# EAGLE board misko_1_board (EAGLE 9.6.2)
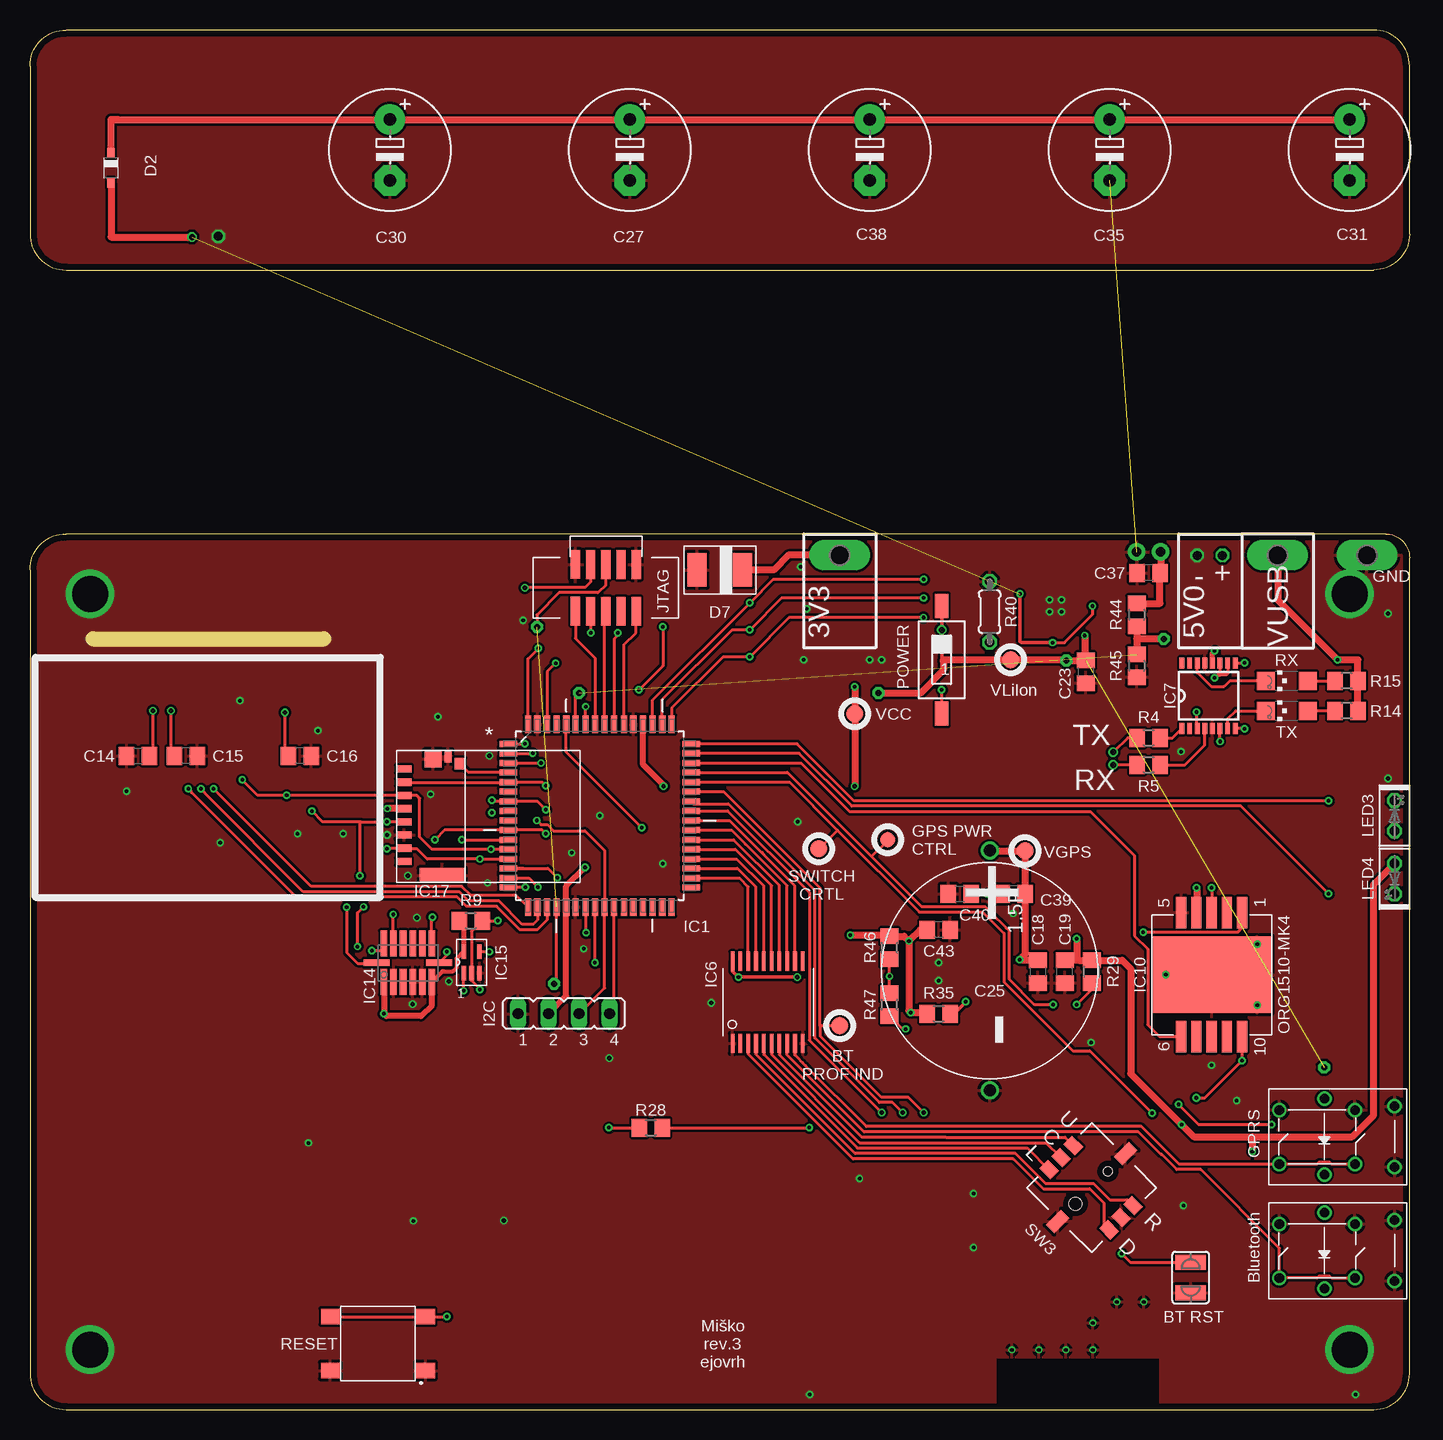
[diagram p6: board, top side]
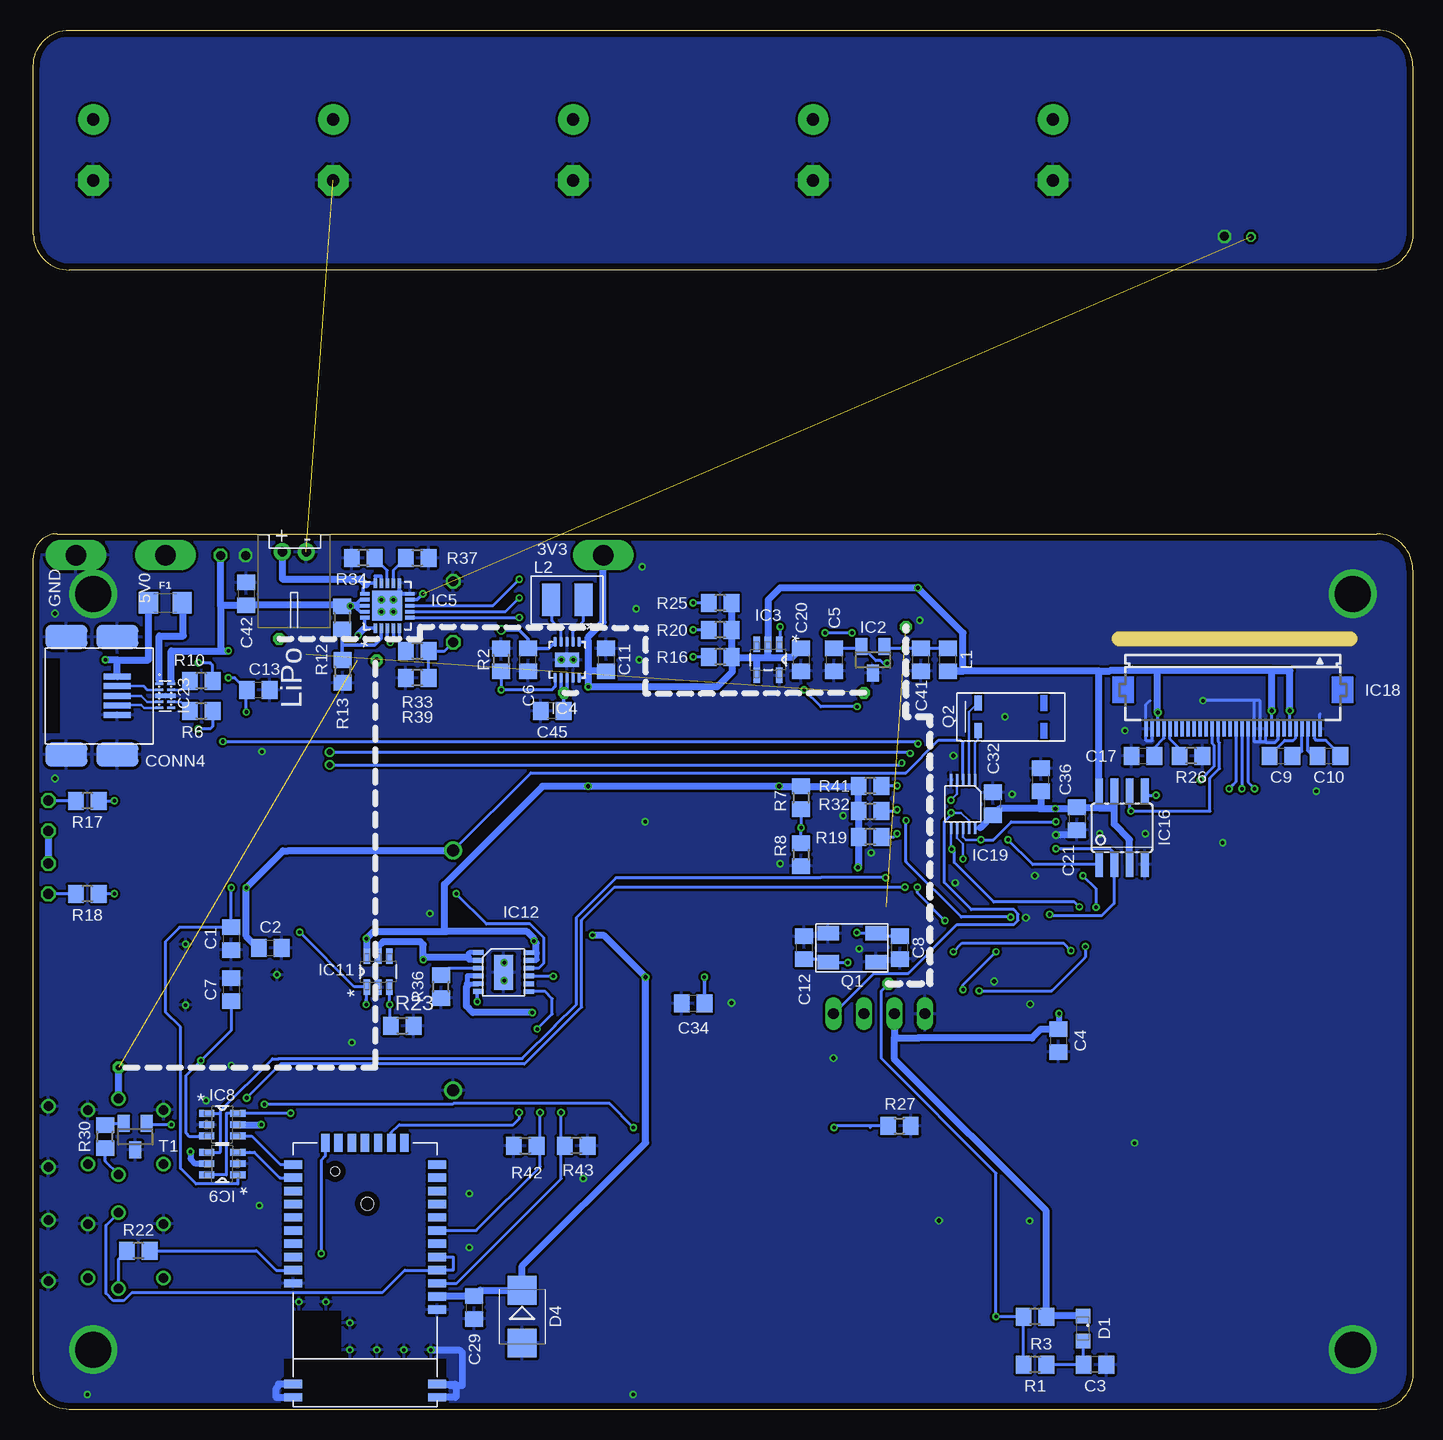
[diagram p7: board, bottom side, seen from below]

Size 115 x 115 mm. Coordinates in mm from the lower left corner, seen from the top.
Outline: 3,0 112,0 arc90 115,3 115,71 arc90 113,73 3,73 arc90 0,70 0,3 arc90 3,0
Outline: 3,95 112,95 arc90 115,98 115,112 arc90 112,115 3,115 arc90 0,112 0,98 arc90 3,95
Copper layers (1*16): Top 0.035mm / dielectric 1.5mm / Bottom 0.035mm
Design rules "markovac_2layer *": minimum track width 0.2mm, minimum drill 0.3mm, track to track 0.2mm, track to pad 0.2mm, pad to pad 0.2mm, via to via 0.2mm, smd to smd 0.2mm, copper to edge 0.5mm, drill to drill 8mil, minimum pad ring 0.15mm, minimum via ring 0.15mm, stop-mask expansion 4mil, vias tented up to drill 25mil, thermal gap 10mil
Net classes: 0 GND: width 0.4 mm, drill 0.25 mm, clearance 0.1 mm; 1 VCC: width 0.6 mm, drill 0.25 mm, clearance 0.1 mm to class 0, clearance 0.1 mm; 2 signal: width 0.25 mm, drill 0.25 mm, clearance 0.1 mm to class 0, clearance 0.1 mm to class 1, clearance 0.1 mm; 3 signal cross-board: width 0.25 mm, drill 0.25 mm, clearance 0.1 mm to class 0, clearance 0.1 mm to class 1, clearance 0.1 mm to class 2, clearance 0.1 mm
Milling: 1 lines

## Footprints (pad centres in the part's own frame; a part is rotated, then mirrored left to right if it is on the bottom)
C0805 = smd 1.3 x 1.5: 1 -0.95,0; 2 0.95,0
TH = drill 1: + 9.84,0; - -10.16,0
E5-10,5 = drill 1.016 pad 2.54: + -2.54,0 | drill 1.016 pad 2.54 octagon: - 2.54,0
TH-JTAG = smd 0.76 x 2.4: 1_JTAG_TCK -2.54,-1.94; 2_GND -2.54,1.955; 3_JTAG_TDO -1.27,-1.95; 4_VCC -1.27,1.95; 5_JTAG_TMS 0,-1.95; 6_JTAG_RST 0,1.95; 7_NC 1.27,-1.95; 8_NC 1.27,1.95; 9_JTAG_TDI 2.54,-1.95; 10_GND 2.54,1.95
JP4 = drill 0.914 long: 1 -3.81,0; 2 -1.27,0; 3 1.27,0; 4 3.81,0
JST-PH-2-THM-RA = drill 0.8 pad 1.422: 1 1,0; 2 -1,0
SMT = smd 2.25 x 0.5: D+ 0,0; D- 0,0.8; GND1 0,-1.6; ID 0,-0.8; VBUS 0,1.6 | smd 3.5 x 2: GND2 -4.25,-4.9; GND3 0,-4.9; GND4 0,4.9; GND5 -4.25,4.9
D0805 = smd 1.2 x 1.2: A 1.05,0; C -1.05,0
SOD323_ST = smd 0.8 x 0.6: A 1.25,0; C -1.25,0
SMB = smd 2.4 x 2.4: A 2.2,0; C -2.2,0
DO-214 = smd 1.6 x 2.8: AN 1.9,0; CAT -1.9,0
1206 = smd 1.6 x 1.8: 1 -1.4,0; 2 1.4,0
QFP80P1600X1600X120-64N = smd 1.473 x 0.508: 1 -7.62,5.994; 2 -7.62,5.207; 3 -7.62,4.394; 4 -7.62,3.607; 5 -7.62,2.794; 6 -7.62,2.007; 7 -7.62,1.194; 8 -7.62,0.406; 9 -7.62,-0.406; 10 -7.62,-1.194; 11 -7.62,-2.007; 12 -7.62,-2.794; 13 -7.62,-3.607; 14 -7.62,-4.394; 15 -7.62,-5.207; 16 -7.62,-5.994; 33 7.62,-5.994; 34 7.62,-5.207; 35 7.62,-4.394; 36 7.62,-3.607; 37 7.62,-2.794; 38 7.62,-2.007; 39 7.62,-1.194; 40 7.62,-0.406; 41 7.62,0.406; 42 7.62,1.194; 43 7.62,2.007; 44 7.62,2.794; 45 7.62,3.607; 46 7.62,4.394; 47 7.62,5.207; 48 7.62,5.994 | smd 0.508 x 1.473: 17 -5.994,-7.62; 18 -5.207,-7.62; 19 -4.394,-7.62; 20 -3.607,-7.62; 21 -2.794,-7.62; 22 -2.007,-7.62; 23 -1.194,-7.62; 24 -0.406,-7.62; 25 0.406,-7.62; 26 1.194,-7.62; 27 2.007,-7.62; 28 2.794,-7.62; 29 3.607,-7.62; 30 4.394,-7.62; 31 5.207,-7.62; 32 5.994,-7.62; 49 5.994,7.62; 50 5.207,7.62; 51 4.394,7.62; 52 3.607,7.62; 53 2.794,7.62; 54 2.007,7.62; 55 1.194,7.62; 56 0.406,7.62; 57 -0.406,7.62; 58 -1.194,7.62; 59 -2.007,7.62; 60 -2.794,7.62; 61 -3.607,7.62; 62 -4.394,7.62; 63 -5.207,7.62; 64 -5.994,7.62
SOT23 = smd 1 x 1.4: 1 -0.95,-1.1; 2 0.95,-1.1; 3 0,1.1
SOT95P280X145-5N = smd 1.27 x 0.559: 1 -1.295,0.94; 2 -1.295,0; 3 -1.295,-0.94; 4 1.295,-0.94; 5 1.295,0.94
SMT' = smd 0.8 x 0.28: 1_VOUT -1.5,1; 2_L2 -1.5,0.5; 3_PGND -1.5,0; 4_L1 -1.5,-0.5; 5_VIN -1.5,-1; 6_EN 1.5,-1; 7_PS/SYNC 1.5,-0.5; 8_VINA 1.5,0; 9_GND1 1.5,0.5; 10_FB 1.5,1 | smd 1.2 x 2: GND2 0,0 | drill 0.3 pad 0.61: GND3 0,0.5; GND4 0,-0.5
QFN50P400X400X100-21N = smd 0.8 x 0.3: 1_OUT1 -1.88,0.991; 2_VPCC -1.88,0.508; 3_SEL -1.88,0; 4_PROG2 -1.88,-0.508; 5_THERM -1.88,-0.991; 11_GND2 1.88,-0.991; 12_PROG3 1.88,-0.508; 13_PROG1 1.88,0; 14_VBAT1 1.88,0.508; 15_VBAT2 1.88,0.991 | smd 0.3 x 0.8: 7_STAT2 -0.508,-1.88; 8_STAT1 0,-1.88; 9_!TE! 0.508,-1.88; 10_GND1 0.991,-1.88; 16_BAT_SENSE 0.991,1.88; 17_CE 0.508,1.88; 18_IN1 0,1.88; 19_IN2 -0.508,1.88; 20_OUT2 -0.991,1.88; !6_PG! -0.991,-1.88 | smd 2.5 x 2.5: GND2 0,0 | drill 0.3 pad 0.61: GND3 -0.5,-0.5; GND4 0.5,-0.5; GND5 0.5,0.5; GND6 -0.5,0.5
TSSOP20 = smd 0.3 x 1.6: !CH! 2.92,3.525; !EN! -2.93,-3.325; GND 2.92,-3.325; IN1 -2.28,-3.325; IN2 -1.63,-3.325; IN3 -0.98,-3.325; IN4 -0.33,-3.325; IN5 0.32,-3.325; IN6 0.97,-3.325; IN7 1.62,-3.325; IN8 2.27,-3.325; OUT1 -2.28,3.525; OUT2 -1.63,3.525; OUT3 -0.98,3.525; OUT4 -0.33,3.525; OUT5 0.32,3.525; OUT6 0.97,3.525; OUT7 1.62,3.525; OUT8 2.27,3.525; VCC -2.93,3.525
SSOP16 = smd 0.914 x 0.406: 1 -2.718,2.223; 2 -2.718,1.587; 3 -2.718,0.953; 4 -2.718,0.318; 5 -2.718,-0.318; 6 -2.718,-0.953; 7 -2.718,-1.587; 8 -2.718,-2.223; 9 2.718,-2.223; 10 2.718,-1.587; 11 2.718,-0.953; 12 2.718,-0.318; 13 2.718,0.318; 14 2.718,0.953; 15 2.718,1.587; 16 2.718,2.223
SOT95P280X145-6N = smd 1.27 x 0.559: 1 -1.295,0.94; 2 -1.295,0; 3 -1.295,-0.94; 4 1.295,-0.94; 5 1.295,0; 6 1.295,0.94
PACKAGE = smd 2.591 x 0.864: 1PPS 5.168,-1.27; CTS -5.168,1.27; GND3 5.168,2.54; ON_OFF 5.168,-2.54; RESET -5.168,0; RTS -5.168,-1.27; RX -5.168,-2.54; TX 5.168,0; VCC 5.168,1.27; WAKEUP -5.168,2.54 | drill 0.3: GND1 -2.54,-3.81; GND4 0,3.81; GND5 2.54,-3.81 | smd 6.4 x 10: GND2 0,0
MSOP = smd 0.4 x 0.9: !PFO! 1.01,2.05; EN 1.65,-2.15; FB 1,-2.15; PFI 0.36,2.05; PFI_RET 1.66,2.05; PROG -0.3,-2.15; SEL 0.35,-2.15; VIN1 -0.94,2.05; VIN2 -1.59,2.05; VMID -0.29,2.05; VOUT1 -1.6,-2.15; VOUT2 -0.95,-2.15 | smd 2.9 x 1.6: GND1 0.05,-0.05 | drill 0.3: GND2 -0.75,0; GND3 0.75,0
SMT'' = smd 0.7 x 1.5: !RST_N! 9.3,0; EAN 8.2,0; P0_0/RTS 4.9,0; P0_5 3.8,0; P1_7/CTS 2.7,0; P2_0 6,0; P2_4 7.1,0 | smd 1.5 x 0.7: BAT_IN 0,12.8; GND7 0,21.2; GND8 0,20.1; GND9 0,13.9; GND10 12,11.7; GND11 12,20.1; GND12 12,21.2; LDO18_O 0,8.4; LDO33_O 0,10.6; LED 12,10.6; P0_4 0,5.1; P1_2/SCL 0,2.9; P1_3/SDA 0,1.8; P1_5 0,4; P3_1 12,4; P3_2 12,5.1; P3_3 12,6.2; P3_4 12,7.3; P3_6 12,8.4; P3_7 12,9.5; PMULDO_O 0,6.2; RXD 12,1.8; SW_BTN 0,11.7; TXD 12,2.9; VDD_IO 0,9.5; WAKEUP 0,7.3 | drill 0.3: GND 0.5,17.25; GND1 2.75,17.25; GND2 5,17.25; GND3 7.25,17.25; GND4 7.25,15; GND5 9.25,13.25; GND6 11.5,13.25
LGA14 = smd 0.55 x 2.145: !CS! 0,-2.6; SCL 0,2.6 | smd 2.145 x 0.55: GND1 -1.6,-1.2; GND2 -1.6,-0.4; GND3 -1.6,1.2; INT1 1.6,-2; INT2 1.6,-1.2; NC 1.6,-0.4; RESERVED1 1.6,0.4; RESERVED2 -1.6,0.4; SDA 1.6,2; SDO 1.6,1.2; VCC -1.6,-2; VDD -1.6,2
SOT353/5 = smd 0.4 x 1.2: A 0,-0.9; B -0.65,-0.9; GND 0.65,-0.9; VCC -0.65,0.9; Y 0.65,0.9
SOIC08 = smd 0.66 x 2.032: !CS! -1.905,-3.073; !HOLD! -0.635,3.073; !WP! 0.635,-3.073; GND 1.905,-3.073; SCK 0.635,3.073; SI 1.905,3.073; SO -0.635,-3.073; VCC -1.905,3.073
MICRO_SD_CONNECTOR = smd 0.6 x 1.25: CD/DAT3 8.35,-0.63; CLK 5.05,-0.63; CMD 7.25,-0.63; DAT0 2.85,-0.63; DAT1 1.75,-0.63; DAT2 9.45,-0.63; VDD 6.15,-0.63; VSS 3.95,-0.63 | smd 0.95 x 0.85: DET 9.9,-5.27 | smd 1.45 x 1.4: GND2 10.3,-3.05 | smd 1.2 x 3.79: GND4 0.6,-3.81 | smd 1 x 0.6: POL 10.5,-4.3
FH12-30S-0.5SH = smd 0.3 x 1.3: 1 -7.25,3.25; 2 -6.75,3.25; 3 -6.25,3.25; 4 -5.75,3.25; 5 -5.25,3.25; 6 -4.75,3.25; 7 -4.25,3.25; 8 -3.75,3.25; 9 -3.25,3.25; 10 -2.75,3.25; 11 -2.25,3.25; 12 -1.75,3.25; 13 -1.25,3.25; 14 -0.75,3.25; 15 -0.25,3.25; 16 0.25,3.25; 17 0.75,3.25; 18 1.25,3.25; 19 1.75,3.25; 20 2.25,3.25; 21 2.75,3.25; 22 3.25,3.25; 23 3.75,3.25; 24 4.25,3.25; 25 4.75,3.25; 26 5.25,3.25; 27 5.75,3.25; 28 6.25,3.25; 29 6.75,3.25; 30 7.25,3.25
10UMAX = smd 1 x 0.2: !CS! -2,-0.5; !INT! 2,0.5; DIN 2,-1; DOUT 2,-0.5; GND -2,-1; SCLK 2,0; VBACK -2,0; VCC 2,1; X1 -2,1; X2 -2,0.5
μDFN-10 = smd 0.2 x 0.675: 1 -1,-0.5; 2 -0.5,-0.5; 4 0.5,-0.5; 5 1,-0.5; 6 1,0.5; 7 0.5,0.5; 9 -0.5,0.5; 10 -1,0.5 | smd 0.4 x 1.7: 3 0,0
L0805 = smd 1.3 x 1.5: 1 -0.95,0; 2 0.95,0
FFF = smd 1.5 x 2.7: P$1 1.35,-0.01; P$2 -1.35,0.01
CHIPLED_1206 = smd 1.5 x 1.5: A 0,-1.75; C 0,1.75
LED2X5 = drill 0.813 octagon: A -1.27,0; K 1.27,0
SMT''' = smd 1.8 x 1.2: GND1 -2,1.2; GND2 2,-1.2; Q1 -2,-1.2; Q2 2,1.2
SMD = smd 0.635 x 1.27: XTAL1 -2.75,-1.15; XTAL2 -2.75,1.15
R0805 = smd 1.3 x 1.5: 1 -0.95,0; 2 0.95,0
0204/5 = drill 0.813 octagon: 1 -2.54,0; 2 2.54,0
SJW = smd 1.27 x 2.54: 1 -1.27,0; 2 1.27,0
430152050836 = smd 1.55 x 1.3: 1 -3.975,2.25; 2 -3.975,-2.25; 3 3.975,2.25; 4 3.975,-2.25
SMS-001 = smd 1.092 x 2.007: 1 0,-4.496; 2 0,4.496
MICROJOYSTICK = smd 1.3 x 1: CENTER -3.575,-0.035; DOWN 3.52,-1.46; GND1 3.52,-0.035; LEFT -3.57,-1.46; RIGHT 3.52,1.39; UP -3.555,1.405 | smd 1 x 1.8: GND2 0,4; GND3 0,-4 | hole 0.75: 0,1.9 | hole 1.05: 0,-1.9
TH' = drill 0.8: 1 9.602,-2.214; 2 3.302,-2.214; 3 9.602,2.286; 4 3.302,2.286; GND1 0,-2.54; GND2 0,2.54; L1 5.85,-3.15; L2 5.85,3.15
P1-17Y = drill 1.702 pad 2.121 long: TP 0,0
TP14R = smd 1.4 x 1.4: TP 0,0
B1,27 = smd 1.27 x 1.27: TP 0,0

## Placement (x,y rotation side)
C1  18pF  [C0805]  98.5,39.25 270 bottom
C2  1µF  [C0805]  95.25,38.5 0 bottom
C3  0.1µF  [C0805]  26.5,3.75 180 bottom
C4  0.1µF  [C0805]  29.55,30.75 270 bottom
C5  10µF  [C0805]  48.25,62.5 270 bottom
C6  10µF  [C0805]  73.75,62.5 90 bottom
C7  18pF  [C0805]  98.5,35 270 bottom
C8  7pF  [C0805]  42.75,38.5 90 bottom
C9  1µF  [C0805]  11,54.5 0 bottom
C10  1µF  [C0805]  7,54.5 0 bottom
C11  22µF  [C0805]  67.25,62.5 270 bottom
C12  7pF  [C0805]  50.75,38.5 270 bottom
C13  0.1µF  [C0805]  96.25,60 0 bottom
C14  1µF  [C0805]  9,54.5 0 top
C15  1µF  [C0805]  13,54.5 180 top
C16  10µF  [C0805]  22.5,54.5 180 top
C17  2.2µF / 25V  [C0805]  22.5,54.5 0 bottom
C18  1nF  [C0805]  84,36.5 270 top
C19  0.1µF  [C0805]  86.25,36.5 90 top
C20  0.1µF  [C0805]  51,62.5 270 bottom
C21  0.1µF  [C0805]  28,49.25 270 bottom
C23  10µF  [C0805]  88,61.5 270 top
C25  1.5F  [TH]  80,36.75 90 top
C27  1000µF  [E5-10,5]  50,105 270 top
C29  10µF  [C0805]  78.25,8.5 270 bottom
C30  1000µF  [E5-10,5]  30,105 270 top
C31  1000µF  [E5-10,5]  110,105 270 top
C32  0.1µF  [C0805]  35,50.5 90 bottom
C34  10µF  [C0805]  60,33.85 180 bottom
C35  1000µF  [E5-10,5]  90,105 270 top
C36  0.1µF  [C0805]  31,52.5 90 bottom
C37  10µF  [C0805]  93.25,69.75 180 top
C38  1000µF  [E5-10,5]  70,105 270 top
C39  100µF  [C0805]  82,43 180 top
C40  100µF  [C0805]  77.5,43 0 top
C41  0.1µF  [C0805]  41,62.5 90 bottom
C42  0.1µF  [C0805]  97.25,68 270 bottom
C43  0.1µF  [C0805]  75.75,40 180 top
C45  0.1µF  [C0805]  71.75,58.25 180 bottom
CONN1  JTAG  [TH-JTAG]  48,68.5 0 top
CONN2  I2C  [JP4]  44.5,33 0 top
CONN3  LiPo Battery  [JST-PH-2-THM-RA]  93.25,71.5 180 bottom
CONN4  USB mini B  [SMT]  108,59.5 0 bottom
D1  1N4148  [D0805]  27.5,6.75 270 bottom
D2  BAT60AE6327  [SOD323_ST]  6.75,103.5 270 top
D4  SZ1SMB5916BT3G  [SMB]  74.25,7.75 270 bottom
D7  BZG05C3V6-E3-TR3  [DO-214]  57.5,70 180 top
F1  PTS120615V050  [1206]  104,67.25 0 bottom
IC1  ATMEGA1281-16AU  [QFP80P1600X1600X120-64N]  47.5,49.5 0 top
IC2  MC1525TT  [SOT23]  45,62.5 180 bottom
IC3  TMP36GRTZ  [SOT95P280X145-5N]  53.75,62.5 270 bottom
IC4  TPS63031  [SMT']  70.5,62.5 270 bottom
IC5  MCP73871-2AAI/ML  [QFN50P400X400X100-21N]  85.49,67.01 90 bottom
IC6  MAX6818  [TSSOP20]  61.5,33.85 0 top
IC7  FT230XS  [SSOP16]  98.25,59.5 90 top
IC8  SN74LVC1G3157DBVR - BT switch  [SOT95P280X145-6N]  99.25,23.75 0 bottom
IC9  SN74LVC1G3157DBVR - GPS switch  [SOT95P280X145-6N]  99.25,20.5 180 bottom
IC10  ORG1510-MK4  [PACKAGE]  98.5,36.25 90 top
IC11  TPS3808G33DBVT  [SOT95P280X145-6N]  86.25,36.5 90 bottom
IC12  LTC4425  [MSOP]  75.75,36.5 270 bottom
IC13  RN4678_BT_MODULE  [SMT'']  81.36,22.22 180 bottom
IC14  ADXL345  [LGA14]  31.5,37.25 90 top
IC15  74HCT1G32  [SOT353/5]  36.81,37.28 0 top
IC16  FM25W256-SOIC  [SOIC08]  24.25,48.5 0 bottom
IC17  MICROSD_SPI_MODE  [MICRO_SD_CONNECTOR]  30.55,43.94 90 top
IC18  FH12-30S-0.5SH  [FH12-30S-0.5SH]  15,60 180 bottom
IC19  DS1394U-33+  [10UMAX]  37.5,50.5 270 bottom
IC23  SP3012-04UTG  [μDFN-10]  104,59.5 270 bottom
L1  DL0805-33 33µH  [L0805]  38.75,62.5 90 bottom
L2  DJNR3015-1R5  [FFF]  70.5,67.5 180 bottom
LED1  TX  [CHIPLED_1206]  104.75,58.25 90 top
LED2  RX  [CHIPLED_1206]  104.75,60.75 90 top
LED3  green  [LED2X5]  113.75,49.5 90 top
LED4  red  [LED2X5]  113.75,44.25 270 top
Q1  ABM3B-8MHZ-10-1-U-T  [SMT''']  46.75,38.5 180 bottom
Q2  LFXTAL016178R  [SMD]  33.5,57.75 0 bottom
R1  47k  [R0805]  31.5,3.75 180 bottom
R2  10k  [R0805]  76,62.49 270 bottom
R3  4k7  [R0805]  31.5,7.75 180 bottom
R4  3k3  [R0805]  93.25,56 0 top
R5  3k3  [R0805]  93.25,53.75 0 top
R6  27  [R0805]  101,58.25 0 bottom
R7  150k  [R0805]  51,51 270 bottom
R8  150k  [R0805]  51,46.25 270 bottom
R9  10k  [R0805]  36.75,40.75 0 top
R10  27  [R0805]  101,60.75 180 bottom
R12  100k  [R0805]  89.25,66 270 bottom
R13  270k  [R0805]  89.21,61.53 270 bottom
R14  1k  [R0805]  109.75,58.25 180 top
R15  1k  [R0805]  109.75,60.75 180 top
R16  47k  [R0805]  57.75,62.75 180 bottom
R17  1k  [R0805]  110.5,50.75 180 bottom
R18  1k  [R0805]  110.5,43 180 bottom
R19  10k  [R0805]  45.25,47.75 180 bottom
R20  47k  [R0805]  57.75,65 180 bottom
R22  1k  [R0805]  106.25,13.25 180 bottom
R23  10k  [R0805]  84.25,32 0 bottom
R25  47k  [R0805]  57.75,67.25 180 bottom
R26  390k  [R0805]  18.5,54.5 180 bottom
R27  10k  [R0805]  42.8,23.65 0 bottom
R28  10k  [R0805]  51.75,23.5 0 top
R29  1M  [R0805]  88.5,36.5 90 top
R30  1k  [R0805]  109,22.75 90 bottom
R32  10k  [R0805]  45.25,49.88 0 bottom
R33  1k  [R0805]  83,63.25 0 bottom
R34  1k  [R0805]  87.5,71 180 bottom
R35  1k  [R0805]  75.75,33 0 top
R36  10k  [R0805]  81,35.25 90 bottom
R37  100k  [R0805]  83,71 0 bottom
R39  270k  [R0805]  83,61 180 bottom
R40  NTC 10k  [0204/5]  80,66.5 90 top
R41  10k  [R0805]  45.25,52 180 bottom
R42  10k  [R0805]  74,22 0 bottom
R43  10k  [R0805]  69.75,22 180 bottom
R44  150k  [R0805]  92.25,66.25 270 top
R45  150k  [R0805]  92.25,62 270 top
R46  470k  [R0805]  71.65,38.5 90 top
R47  470k  [R0805]  71.65,33.75 90 top
SJ3  RESET  [SJW]  96.75,11 270 top
SW1  RESET  [430152050836]  29,5.5 180 top
SW2  POWER SWITCH  [SMS-001]  76,62.5 0 top
SW3  MICROJOYSTICK  [MICROJOYSTICK]  88.5,18.5 315 top
SW4  PB6156RSL  [TH']  113.75,13.25 180 top
SW5  PB6156RSL  [TH']  113.75,22.75 180 top
T1  BSS84  [SOT23]  106.5,22.75 180 bottom
TP1  GND  [P1-17Y]  111.45,71.21 270 top
TP2  GND  [P1-17Y]  104,71.22 270 top
TP3  GND  [P1-17Y]  67.5,71.22 270 top
TP4  VCC  [TP14R]  68.75,58 180 top
TP5  VLiIon Regulated  [TP14R]  81.75,62.5 0 top
TP6  VGPS  [TP14R]  82.94,46.58 0 top
TP7  Analogue Switch CRTL Pin  [TP14R]  65.76,46.77 0 top
TP8  GPS Power CTRL Pin  [B1,27]  71.5,47.5 0 top
TP11  Bluetooth Wakeup Pin  [TP14R]  67.5,32 0 top

## Tracks (layer width: path | path; a pad name or v marks a point on that pad's centre or on a via)
5V0  (via drill 0.3, 0.5, 0.75)  (1 unrouted)
  Top 0.25: v85.25,63.93 86.23,63.93 88.6,66.3 88.6,66.95 v88.57,66.98
  Top 0.3: v85.25,63.93 82.63,63.93 82.53,64.03 v82.53,68
  Top 0.4: IC7.12 98.57,63.07 v98.75,63.25
  Top 0.6: D2.A 6.75,97.75 v13.5,97.75 | 99.42,71.19 v99.4,71.2
  Bottom 0.25: IC23.10 103.5,60.69
  Bottom 0.3: IC5.19_IN2 87.75,66.5 88,66.75 88,67.03 | IC5.17_CE 87.73,67.52 88,67.25 88,67.03 | IC5.18_IN1 87.98,67.01 88,67.03 | 88.54,67.01 v88.57,66.98 | IC5.4_PROG2 84.98,64.2 v85.25,63.93 85.49,64.17 IC5.3_SEL | IC5.9_!TE! 83.01,67.52 v82.53,68
  Bottom 0.6: 87.98,67.01 88.54,67.01 | v88.57,66.98 89.16,66.98 89.23,67.05 | 89.23,67.05 C42.2 99.35,67.05 99.4,67 | R12.1 89.25,67.03 89.23,67.05 | 99.4,67 v99.4,71.2 | 99.4,67 99.4,63.25 | 99.4,63.25 v98.75,63.25 | 103.5,60.69 103.5,63.25 99.4,63.25
ADXL345_INT1_INTERRUPT_PIN  (via drill 0.3)
  Top 0.25: v42.24,49.09 v42.25,49.1 42.6,48.76 43.13,48.76 43.63,48.25 46.25,48.25 47.91,46.59 IC1.25 47.91,41.5 47.91,35.14 CONN2.3 | v33.54,41.05 33.48,40.99 33.48,38.85 IC14.INT1
  Bottom 0.25: v42.25,49.1 42.25,45.65 37.65,41.05 v33.54,41.05
ADXL345SDA  (via drill 0.3)
  Top 0.25: v28.5,38.25 29.5,38.25 IC14.SDA | IC15.Y 38.27,38.18 v38.3,38.15
  Bottom 0.25: v28.5,38.25 29.13,38.88 37.57,38.88 v38.3,38.15
ANALOG_SW_CTRL_PIN  (via drill 0.3)
  Top 0.25: 67.32,48.29 63.32,52.29 IC1.44 | 67.32,48.29 74.14,41.48 79.4,41.48 81.19,39.69 81.19,35.63 86.92,29.9 88.35,29.9 v93.55,24.7 | TP7.TP 65.81,46.77 67.32,48.29
  Bottom 0.25: IC9.6 98.92,19.56 98.92,24.69 IC8.6 v93.56,24.69 v93.55,24.7
AREF  (via drill 0.3)
  Top 0.25: v43.82,62.22 43.11,61.51 IC1.62
  Bottom 0.25: 46,63.55 46,63.28 46.17,63.45 | C5.1 46.1,63.45 46,63.55 | 46,63.55 IC2.2 44.77,62.42 44.37,62.42 44.16,62.22 v43.82,62.22
AVCC  (via drill 0.3)
  Top 0.25: IC1.64 41.51,62.58 v42.38,63.45
  Bottom 0.25: IC2.1 43.9,63.45 v42.38,63.45 C41.2 L1.2
BAT_A_PIN  (via drill 0.5 pad 1)  (1 unrouted)
  Top 0.25: IC1.59 45.49,59.49 v45.75,59.75
  Top 0.6: v94.5,64.25 92.25,64.25 | R44.2 92.25,64.25 | 92.25,64.25 R45.1
BLUETOOTH_PROF_IND_PIN  (via drill 0.35)
  Top 0.25: IC1.43 57.83,51.51 65.87,43.47 65.87,32 | v74.5,24.75 73.22,26.04 70.99,26.04 65.87,31.15 65.87,31.91 65.87,32 | TP11.TP 65.87,32
  Bottom 0.25: v74.5,24.75 74.5,24.25 75,23.75 84.49,23.75 85.16,23.09 IC13.P0_5
BLUETOOTH_RX
  Bottom 0.25: 97.8,22.66 IC8.4 96.81,22.81 94.42,20.42 IC13.RXD
BLUETOOTH_SWITCH_PIN  (via drill 0.35)
  Top 0.25: v71,24.75 64.97,30.78 64.97,43.09 58.16,49.91 IC1.41
  Bottom 0.25: 71,21.97 v71,24.75 | 71,21.97 71,19.25 79.73,10.52 IC13.SW_BTN | R43.2 70.97,22 71,21.97
BLUETOOTH_TX
  Bottom 0.25: 97.93,21.46 IC9.3 | IC9.3 96.94,21.44 | IC9.3 96.58,21.44 94.46,19.32 IC13.TXD
BLUETOOTH_WAKEUP_PIN  (via drill 0.35)
  Top 0.25: IC1.42 55.33,50.48 58.21,50.48 65.42,43.28 65.42,30.97 70.8,25.59 71.92,25.59 v72.75,24.75
  Bottom 0.25: 72.75,22.02 v72.75,24.75 | 72.75,22.02 72.75,20.25 78.08,14.92 IC13.WAKEUP | R42.2 72.77,22 72.75,22.02
BT_LED
  Bottom 0.25: R22.1 96.39,13.25 94.76,11.62 IC13.LED
BUTTON_BLUETOOTH
  Top 0.25: IC6.IN7 63.12,29.56 69.54,23.14 92.41,23.14 94.28,21.27 94.34,21.27 95.6,20.01 97.59,20.01 104.15,13.45 SW4.3 107.31,10.96 107.47,11.13 108.33,11.13 108.49,10.96 SW4.4
BUTTON_CENTER
  Top 0.25: SW3.CENTER 84.7,22.25 69.16,22.25 61.82,29.59 IC6.IN5
BUTTON_DOWN
  Top 0.25: IC6.IN2 59.87,29.63 68.61,20.89 81.97,20.89 84.46,18.4 88.35,18.4 89.5,17.25 89.5,15.44 SW3.DOWN
BUTTON_GPRS
  Top 0.25: 63.77,29.64 IC6.IN8 | 63.77,29.64 63.77,29.55 | 64.66,28.66 64.41,28.91 | 64.66,28.66 63.77,29.55 | 63.77,29.55 63.77,29.64 | 64.66,28.66 69.72,23.59 92.66,23.59 95.79,20.46 SW5.3 107.31,20.46 107.47,20.63 108.33,20.63 108.49,20.46 SW5.4
BUTTON_LEFT
  Top 0.25: IC6.IN4 61.17,29.6 68.98,21.8 83.14,21.8 SW3.LEFT 84.94,20.06
BUTTON_RIGHT
  Top 0.25: IC6.IN3 60.52,29.62 68.79,21.34 82.16,21.34 84.65,18.85 88.65,18.85 90,17.5 91.47,17.5 SW3.RIGHT
BUTTON_UP
  Top 0.25: 86.74,22.01 SW3.UP 86.29,22.7 76.33,22.7 75.5,22.7 69.35,22.7 62.47,29.58 IC6.IN6
CAP1N
  Bottom 0.25: IC18.5 9.78,56.73 9.78,55.97 9.96,55.77 10.68,55.77 C9.1
CAP1P
  Bottom 0.25: IC18.4 9.25,54.89 9.64,54.5 C9.2
CAP2N
  Bottom 0.25: IC18.3 8.75,54.9 8.35,54.5 C10.1
CAP2P
  Bottom 0.25: IC18.2 8.22,56.73 8.22,55.97 8.04,55.77 7.25,55.77 6.05,54.57 C10.2
CBUS1
  Top 0.25: LED2.C 100.03,60.75 99.55,60.27 98.46,60.27 97.3,61.44 IC7.14 97.3,61.73
CBUS2
  Top 0.25: IC7.7 99.84,57.59 100.5,58.25 LED1.C
D+
  Bottom 0.2: IC23.4 105.5,59 106,59.5 CONN4.D+
D-
  Bottom 0.2: IC23.2 105.5,60 105.8,60.3 CONN4.D-
EN  (via drill 0.3)
  Top 0.25: SW2.1 v76,60
  Bottom 0.25: R2.2 v76,60 71.75,60 71.5,60.25 IC4.6_EN
GND  (via drill 0.3, 0.35, 0.75, 3)  (1 unrouted)
  Bottom 0.25: 13.25,59.1 IC18.12 13.25,55.67 12.75,55.67 | 13.25,59.1 v17.5,59.1 | 13.25,59.1 12.75,59.1 IC18.11 12.75,55.67 | 21.92,59.1 22.25,58.77 IC18.30 22.25,55.75 21.75,55.75 IC18.29 | IC18.8 11.25,55.84 11.49,55.6 12.25,55.6 12.25,55.67 | 12.25,55.67 IC18.10 | 12.75,55.67 12.25,55.67 | IC18.1 7.75,58
  Bottom 0.35: 84.5,68 IC5.10_GND1 | 84.5,68 84.99,68 IC5.GND4 | IC5.11_GND2 84.5,68 | IC5.GND2 84.5,67.01 84.5,68
  Bottom 0.6: IC13.GND7 79.83,1.02 79.75,1.1 79.75,2.04 79.83,2.12 IC13.GND8 | IC13.GND 79.47,4.97 79.25,4.75 79.25,2 80.26,2 80.31,2.04 | IC13.GND12 93.36,1 94.75,1 94.75,1.77 94.59,1.94 | 94.59,1.94 94.41,2.12 | IC13.GND11 94.59,2.12 94.59,1.94 | v29.76,47.9 28,47.9 C21.2
  other vias: 5,5 5,68 110,5 110,68 34,57.75 100.6,25.75 96.15,17 52.75,45.5 110.5,1.25 65,1.25 31.9,33.8 56.8,33.9 48.3,29.3 41.1,65.8 81.95,41.35 98.5,28.7 97.3,71.2 15.7,97.8 39.5,15.75 31.95,15.72 113.2,66.35 113.2,52.6 47.5,49.5 8.05,51.55 31.5,44.5 33.4,51.3 22.3,48 45.15,46.4 38.3,54.5 26.1,48 15.85,47.25 24,56.6 34.91,35.68 64.5,62.5 32.25,41 95.95,54.85 64.75,66.75 88.45,30.6 64,49 78.65,13.5 38.15,43.9 78.65,18 69.15,19.25 23.2,22.22 64.25,70.25 46.15,38.4
  pour Bottom: 0,73 115,73 115,0 0,0
  pour Top: 0,0 115,0 115,73 0,73
  pour Top: 0,115 115,115 115,95 0,95
  pour Bottom: 0,115 115,115 115,95 0,95
GPRS_NETLIGHT  (via drill 0.3)
  Top 0.25: 50.68,23.62 R28.1 v48.25,23.5
  Bottom 0.25: 45.25,23.5 45.1,23.65 R27.1 48.1,23.65 v48.25,23.5
GPRS_NETLIGHT_GATE  (via drill 0.3)
  Top 0.25: v95.74,25.44 97.43,23.75 v103.5,23.75 | R28.2 v64.97,23.5
  Bottom 0.25: v103.5,23.75 105.45,23.75 T1.1 | v64.97,23.5 66.98,25.5 79.97,25.5 80.03,25.44 v95.74,25.44
GPS_GREEN_LED_PIN  (via drill 0.3)
  Top 0.25: IC1.48 63.95,55.49 68.7,50.75 v108.25,50.75
  Bottom 0.25: R17.1 v108.25,50.75
GPS_ON_OFF  (via drill 0.3)
  Top 0.25: R29.1 88.5,35.01 v87.25,33.76 | v92.8,39.8 95.39,39.8 100.7,39.8 100.83,39.92 | 100.83,39.92 101.1,40.2 | IC10.ON_OFF 101.04,40.14 100.83,39.92
  Bottom 0.25: 87.25,34.25 v87.25,33.76 87.25,35.14 IC11.1 87.23,35.25 88.25,35.25 v92.8,39.8
GPS_POWER_CTL_PIN  (via drill 0.3)
  Top 0.25: 81.38,40.14 81.64,39.88 81.64,35.86 83.75,33.75 v85.29,33.75 | 81.38,40.14 | 80.02,41.49 79.59,41.92 | 80.02,41.49 81.38,40.14 | IC1.45 63.14,53.11 70.16,46.09 | TP8.TP 71.5,47.43 70.16,46.09 | 70.16,46.09 74.33,41.92 79.59,41.92 | 80.02,41.49 | 79.59,41.92 80.02,41.49
  Bottom 0.25: IC11.3 85.31,33.77 v85.29,33.75 85.29,32.09 R23.1
GPS_RED_LED_PIN  (via drill 0.3)
  Top 0.25: 102.3,48.95 v108.25,43 | 102.3,48.95 101.35,49.9 | IC1.47 64.1,54.71 68.51,50.3 100.95,50.3 102.3,48.95
  Bottom 0.25: v108.25,43 R18.1
GPS_SW_SERIAL_RX  (via drill 0.3)
  Top 0.25: 41.14,45.11 IC1.14 43.18,45.11 v43.95,44.34
  Bottom 0.25: 100.45,21.44 IC9.4 99.4,21.44 99.4,24.69 | IC8.1 99.4,24.69 | v43.95,44.34 49.35,44.34 49.37,44.33 66.42,44.33 69.75,41 69.75,33.75 71.5,32 74.24,29.25 94.57,29.25 95.07,29.25 99.4,24.92 99.4,24.69
GPS_SW_SERIAL_TX  (via drill 0.3, 0.35)
  Top 0.25: IC1.15 41.59,44.29 v42.34,43.54 | v97.22,25.97 97.92,25.97 v101.04,29.08 IC10.RX
  Bottom 0.25: 100.48,22.81 IC8.3 | IC8.3 100.98,22.81 101.04,22.87 | 101.26,22.81 IC8.3 | 101.56,28.56 v101.04,29.08 | v42.34,43.54 43.02,43.54 43.02,43.53 66.58,43.53 69.3,40.81 69.3,33.56 74.06,28.8 94.38,28.8 v97.22,25.97 | C7.2 98.5,31.62 v101.04,29.08 | v101.04,29.08 102.27,27.85 102.27,23.02 102,22.75 100.61,22.75 IC8.3
GPS_TX  (via drill 0.3)
  Top 0.25: v98.5,43.5 IC10.TX
  Bottom 0.25: C1.1 98.5,40.29 98.72,40.29 | C1.1 102.8,40.2 104,39 104,33.16 102.72,31.89 102.72,20.09 101.43,18.8 97.95,18.8 IC9.1 | C1.1 v98.5,43.5
GPS_WAKEUP_PIN
  Top 0.25: IC1.46 64.28,53.89 68.33,49.85 88.4,49.85 92.07,46.18 92.07,39.5 93.17,38.39 93.17,32.08 94.12,31.12 | 94.12,31.12 94.17,31.08 | IC10.WAKEUP 94.17,31.08 | 94.17,31.08 94.12,31.12
GREEN_LED
  Bottom 0.25: R17.2 113.73,50.75 LED3.K
ID
  Bottom 0.2: IC23.5 105.75,58.5 106,58.75 107.95,58.75 CONN4.ID
IREF
  Bottom 0.25: IC18.26 20.25,55.89 19.45,55.09 R26.2
JTAG_TCL_PIN
  Top 0.25: IC1.57 47.09,62.66 45.46,64.29 CONN1.1_JTAG_TCK
JTAG_TDI_PIN
  Top 0.25: CONN1.9_JTAG_TDI 50.54,66.5 50.5,66.46 50.5,64.75 49.51,63.76 IC1.54
JTAG_TDO_PIN  (via drill 0.3)
  Top 0.25: IC1.55 48.69,64.25 49,64.56 v49,64.75 | v46.75,64.75 46.75,66.53 CONN1.3_JTAG_TDO
  Bottom 0.25: v46.75,64.75 v49,64.75
JTAG_TMS_PIN
  Top 0.25: IC1.56 47.91,66.46 CONN1.5_JTAG_TMS
L2
  Bottom 0.25: SW4.L2 107.9,12.55 R22.2
L_L1
  Bottom 0.25: 71.85,66.42 L2.P$1 71.75,67.41 71.75,65.75 71,65 IC4.4_L1
L_L2
  Bottom 0.25: L2.P$2 69.15,65.72 70,64.87 IC4.2_L2
LDO33_O
  Bottom 0.25: SW4.L1 108.93,15.37 108.93,9.67 108.33,9.07 107.47,9.07 106.78,9.77 85.89,9.77 84.04,11.62 IC13.LDO33_O 80,11.62 80,12.72 IC13.VDD_IO
LTC4425_EN  (via drill 0.3)
  Top 0.25: 77.25,33 R35.2
  Top 0.3: R35.2 77,33 v78,34
  Bottom 0.3: v78,34 78,34.75 IC12.EN
LTC4425_PROG
  Bottom 0.25: R36.2 80.4,36.8 IC12.PROG
MCP73871_CHARGE_STATUS_1_PIN  (via drill 0.3)
  Top 0.25: v74.5,69.2 61.95,69.2 v60,67.25 51.89,59.14 IC1.51
  Bottom 0.25: R25.2 v60,67.25 | v74.5,69.2 76.69,67.01 IC5.8_STAT1
MCP73871_CHARGE_STATUS_2_PIN  (via drill 0.3)
  Top 0.25: IC1.50 52.71,59.17 58.54,65 v60,65 62.65,67.65 v74.5,67.65
  Bottom 0.25: R20.2 v60,65 | v74.5,67.65 75.65,66.5 IC5.7_STAT2
MCP73871_POWER_GOOD_PIN  (via drill 0.3)
  Top 0.25: v74.49,66.02 63.27,66.02 v60,62.75 57.77,62.75 53.49,58.47 IC1.49
  Bottom 0.25: IC5.!6_PG! v74.49,66.02 | R16.2 v60,62.75
MENU_BLUETOOTH_POWER_BUTTON_PIN
  Top 0.25: IC6.OUT7 63.12,43.67 59.84,46.95 | 59.84,46.95 59.65,47.15 | IC1.39 58.48,48.31 59.84,46.95
MENU_CENTER_BUTTON_PIN
  Top 0.25: IC6.OUT5 61.82,43.68 58.8,46.71 IC1.37
MENU_DOWN_BUTTON_PIN
  Top 0.25: IC6.OUT2 59.87,43.57 59.15,44.29 IC1.34
MENU_GPRS_POWER_BUTTON_PIN
  Top 0.25: IC6.OUT8 63.77,43.66 61.15,46.27 | 61.15,46.27 60.96,46.46 | IC1.40 58.33,49.09 61.15,46.27
MENU_LEFT_BUTTON_PIN
  Top 0.25: IC6.OUT4 61.17,43.63 58.91,45.89 IC1.36
MENU_RIGHT_BUTTON_PIN
  Top 0.25: IC6.OUT3 60.52,43.56 58.97,45.11 IC1.35
MENU_UP_BUTTON_PIN
  Top 0.25: IC6.OUT6 62.47,43.68 58.66,47.49 IC1.38
N$1
  Bottom 0.25: SW5.L2 109,20.7 R30.1
N$3
  Bottom 0.25: R30.2 108.85,23.85 T1.2
N$4
  Bottom 0.25: IC23.1 104.5,60.75
  Bottom 0.6: 104.5,60.75 104.5,64.5 102.5,64.5 102.5,67.25 F1.2
N$6
  Top 0.6: C31.+ C35.+ C38.+ C27.+ C30.+ 7.35,107.54 | 7.35,107.54 6.75,107.54 | D2.C 6.75,107.54 | 6.75,107.54 7.35,107.54
N$10  (via drill 0.3)
  Top 0.25: IC7.10 99.84,61.34 99.79,61.29 | 99.79,61.29 | IC7.11 99.2,61.3 | 99.25,61.25 99.2,61.3 | 99.75,61.25 99.79,61.29 | IC7.3 97.25,56.83 v97.25,58.15 | 99.79,61.29 99.75,61.25 | 99.75,61.25 99.25,61.25 | 99.2,61.3 98.91,61 v98.75,61 99,61.25 99.25,61.25
  Bottom 0.25: 97.22,60.02 C13.1 97.25,59.95 v97.25,58.15 | 97.22,60.02 98.2,61 v98.75,61 | 97.25,60 97.22,60.02
N$11  (via drill 0.3)
  Top 0.25: v91,13 91.73,12.27 SJ3.1
  Bottom 0.25: v91,13 91,20.79 90.66,21.13 IC13.!RST_N!
N$19
  Bottom 0.25: R39.1 R33.2 80.71,63.25 R40.1
N$31
  Bottom 0.25: D1.A 27.5,3.8 C3.2 R1.1
PDI_UART0_CTS_PIN  (via drill 0.3)
  Top 0.25: v99.2,55.68 IC7.6 | IC1.1 v41.24,55.49 v41.25,55.5
  Bottom 0.25: v99.2,55.68 41.43,55.68 v41.25,55.5
PDI_UART0_RX_PIN  (via drill 0.3, 0.5)
  Top 0.25: IC1.2 41.89,54.71 v41.9,54.69 | R4.1 91.51,56 v90.3,54.79
  Bottom 0.25: v90.3,54.79 42,54.79 v41.9,54.69
PDI_UART0_TX_PIN  (via drill 0.3, 0.5)
  Top 0.25: R5.1 v90.3,53.75 | IC1.3 v42.59,53.89 v42.6,53.9
  Bottom 0.25: v90.3,53.75 42.75,53.75 v42.6,53.9
PFI  (via drill 0.3)
  Top 0.25: R47.2 v71.65,36.12 R46.1
  Bottom 0.25: IC12.PFI 71.67,36.14 v71.65,36.12
PFI_RET  (via drill 0.3)
  Top 0.25: v73,31.72 72.73,31.72 R47.1
  Bottom 0.25: IC12.PFI_RET 72.34,34.84 71.75,34.25 71.75,32.97 v73,31.72
PROG1
  Bottom 0.25: IC5.13_PROG1 85.49,69.94 R34.1
PROG3
  Bottom 0.25: IC5.12_PROG3 84.98,69.97 R37.1
RED_LED
  Bottom 0.25: R18.2 113.73,43 LED4.K
RESET  (via drill 0.3, 0.5 pad 1)  (1 unrouted)
  Top 0.25: IC1.20 43.89,35.56 43.84,35.5 v43.7,35.5 | v34.75,7.75 SW1.2 SW1.4 | v42.25,65.25 42.25,66.25 44.09,68.08 47.34,68.08 48,68.75 CONN1.6_JTAG_RST
  Bottom 0.25: R3.2 33,8.3 | R3.2 v34.75,7.75 34.75,19.71 44.32,29.28 44.32,34.88 v43.7,35.5 | R1.2 R3.2
RTC_INT_INTERRUPT_PIN  (via drill 0.3)
  Top 0.25: 38.66,49.91 v38.49,49.74 | CONN2.4 48.69,33.38 IC1.26
  Bottom 0.2: IC19.!INT! 37,49.09 37.65,49.74 v38.49,49.74
  Bottom 0.25: CONN2.4 44.94,36.38 42.06,36.38 38.02,40.42 33.28,40.42 32.91,40.79 32.91,41.31 33.28,41.67 36.81,41.67 39.06,43.92 39.06,49 38.49,49.57 v38.49,49.74
RTC_XTAL1
  Bottom 0.2: IC19.X1 36.5,55.54 36.25,55.79 Q2.XTAL1
RTC_XTAL2
  Bottom 0.2: Q2.XTAL2 37,58.15 IC19.X2
RXD
  Top 0.25: IC7.4 97.93,55.39 96.29,53.75 R5.2
SD_CARD_DETECT_PIN
  Top 0.25: IC1.4 36.55,53.11 IC17.DET
SPI_MISO_PIN  (via drill 0.3)
  Top 0.25: IC1.13 v37.5,45.89 33.11,45.89 32.25,46.75 31.22,46.75 IC17.DAT0 29.79,46.79 v29.75,46.75 | IC14.SDO 30.28,38.85 v30.28,41.27
  Bottom 0.2: v37.5,45.89 37.5,47.15 38,47.65 IC19.DOUT
  Bottom 0.25: v29.75,46.75 26.64,46.75 26.62,46.77 25.27,46.77 25,46.5 25,45.54 IC16.SO | 24.89,44.12 IC16.SO | IC16.SO 24.89,42.21 24.92,42.18 25.95,41.15 30.16,41.15 v30.28,41.27
SPI_MOSI_PIN  (via drill 0.3)
  Top 0.25: IC1.12 v38.43,46.71 33.51,46.71 32.5,47.72 32.5,50.95 32.26,51.19 IC17.CMD v21.41,51.19 v21.4,51.2 18.99,51.2 v17.7,52.49 | v36.16,34.91 IC15.B | v27.3,38.6 27.3,41.4 v27.8,41.9
  Bottom 0.2: IC19.DIN 38.5,46.71 v38.43,46.71
  Bottom 0.25: 22.27,51.5 IC16.SI 21.97,51.2 v21.4,51.2 | v27.3,38.6 27.3,37.7 30.09,34.91 v36.16,34.91 | v27.8,41.9 28.2,42.3 34.94,42.3 38.23,45.59 38.23,46.5 v38.43,46.71 | v17.7,52.49 16.57,53.62 16.57,55.38 16.75,55.56 IC18.19
SPI_OLED_D/C_PIN  (via drill 0.3)
  Top 0.25: IC1.17 40.54,42.85 36.75,42.85 35.98,43.62 23.44,43.62 v15.31,51.75
  Bottom 0.25: IC18.15 14.75,52.32 15,52.06 15,52.05 v15.31,51.75
SPI_OLED_RESET_PIN  (via drill 0.3)
  Top 0.25: v14.25,51.75 14.53,51.47 14.53,51.43 22.79,43.16 35.8,43.16 36.57,42.4 39.09,42.4 41.04,40.45 41.95,40.45 42.29,40.79 IC1.18
  Bottom 0.25: IC18.14 v14.25,51.75
SPI_SCK_PIN  (via drill 0.3)
  Top 0.25: IC17.CLK v29.75,49 27.56,49 | v36,47.49 IC1.11 | 23.39,50 v23.5,49.89 24.39,49 27.56,49 | IC14.SCL 28.68,37.25 28.63,37.2 27.3,37.2 26.4,38.1 v26.4,41.88 | v27.5,44.5 27.5,48.94 27.56,49
  Bottom 0.2: IC19.SCLK 37.5,47.75 37.24,47.49 v36,47.49
  Bottom 0.25: IC16.SCK 23.61,50 v23.5,49.89 16.92,49.89 16.92,52.63 16.12,53.43 16.12,55.57 16.25,55.7 IC18.18 | v29.75,49 33.48,49 34.98,47.49 v36,47.49 | v26.4,41.88 26.4,43.4 v27.5,44.5
SPI_SS_ADXL345_PIN  (via drill 0.3)
  Top 0.25: v37.5,35 37.5,35.08 36.81,35.77 IC15.A 36.81,39.86 R9.2 v39,40.75 | IC1.16 39.92,43.55 v41.3,43.55 | v34.75,38.15 34.75,37.9 IC14.!CS!
  Bottom 0.25: v39,40.75 41.3,43.05 v41.3,43.55 | v37.5,35 37.5,35.4 v34.75,38.15
SPI_SS_FRAM_PIN  (via drill 0.3)
  Top 0.25: v43,48 42.69,48.31 IC1.10 34.56,48.31 v33.75,47.5
  Bottom 0.25: 26.23,45.5 IC16.!CS! 31.68,45.43 v33.75,47.5 | R19.1 43.25,47.75 v43,48
SPI_SS_OLED_PIN  (via drill 0.3)
  Top 0.25: v13.19,51.75 13.47,51.47 13.47,51.43 22.18,42.72 35.61,42.72 36.38,41.95 38.91,41.95 40.85,40 42.27,40 43.11,40.83 IC1.19
  Bottom 0.25: IC18.13 13.75,52.32 13.5,52.06 13.5,52.05 v13.19,51.75
SPI_SS_RTC_PIN  (via drill 0.3)
  Top 0.25: v43,50 42.31,50.69 IC1.7 38.61,50.69 v38.5,50.8
  Bottom 0.2: IC19.!CS! 38,51.3 v38.5,50.8
  Bottom 0.25: R32.2 43.12,49.88 v43,50
SPI_SS_SD_CARD_PIN  (via drill 0.3)
  Top 0.25: IC1.5 39.75,52.29 39.8,52.25 | IC1.5 40.02,52.29 IC17.CD/DAT3 | IC1.5 42.71,52.29 v43,52
  Bottom 0.25: v43,52 R41.1
THERM
  Bottom 0.25: IC5.5_THERM 84.5,63.8 R33.1
TMP36_VSENSE_PIN  (via drill 0.3)
  Top 0.25: IC1.58 46.31,58.58 v46.32,58.6 | v52.75,65.25 52.75,62 v50.75,60
  Bottom 0.25: v52.75,65.25 52.75,63.86 IC3.1 | v46.32,58.6 49.35,58.6 v50.75,60
TXD
  Top 0.25: 96,56.81 IC7.1 95.25,56 R4.2
USB_D+
  Bottom 0.2: IC23.7 102.7,59 R6.1
USB_D-
  Bottom 0.2: IC23.9 102.7,60 R10.2
USB_RX_LED
  Top 0.25: R14.2 LED1.A
USB_TX_LED
  Top 0.25: LED2.A R15.2
USBDM  (via drill 0.3)
  Top 0.25: IC7.9 100.5,62.25 v101.25,62.25
  Bottom 0.25: R10.1 100.05,62.05 100.25,62.25 v101.25,62.25
USBDP  (via drill 0.3)
  Top 0.25: v101.25,56.75 101.22,56.78 IC7.8
  Bottom 0.25: R6.2 100.05,56.95 100.25,56.75 v101.25,56.75
V_LIION+
  Top 0.6: 92.3,67.2 R44.1 94.2,67.2 C37.1 94.25,69.8 CONN3.1
  Bottom 0.3: IC5.15_VBAT2 | IC5.16_BAT_SENSE 87.5,68.13 87.5,68.5 87.25,68.75 87.11,68.89 IC5.15_VBAT2 | IC5.14_VBAT1 86,69.5 86.5,69.5 86.48,69.48 IC5.15_VBAT2
  Bottom 0.6: 87.25,68.75 87.75,69.25 94.25,69.25 CONN3.1
V_LIION_REGULATED  (via drill 0.3, 0.5, 0.5 pad 1)  (1 unrouted)
  Top 0.3: SW2.2 v76,65 76,62.59 76.14,62.45
  Top 0.6: 76.14,62.39 76.14,61.64 74.25,59.75 v70.74,59.75 | 76.14,62.39 76.14,62.45 | v87.93,64.52 87.93,62.58 88.03,62.48 C23.1 v86.4,62.45 86.35,62.5 TP5.TP 76.25,62.5 76.14,62.39
  Bottom 0.3: IC4.5_VIN 72.05,63.45 C6.2 73.75,64.25 74.5,65 v76,65 | IC4.7_PS/SYNC 71,60.01 v70.74,59.75 | IC4.8_VINA 70.5,59.99 v70.74,59.75 | IC5.1_OUT1 87.38,65.13 87.37,65.14 IC5.20_OUT2 | C45.1 70.8,59.69 v70.74,59.75
  Bottom 0.6: v87.93,64.52 87.93,64.58 87.38,65.13 | SW5.L1 107.9,28.5 v107.88,28.52
VCC  (via drill 0.3, 0.35)
  Top 0.25: C15.2 11.75,54.8 v11.75,58.25 | C14.2 10.25,54.8 v10.25,58.25 | C16.2 21.25,54.8 v21.25,58.1 | CONN1.4_VCC 46.73,68.98 46.28,68.53 41.28,68.53 v41.25,68.5
  Top 0.3: IC6.VCC 58.57,36.53 v59.06,36.04 v63.97,36.04
  Top 0.35: IC15.VCC 35.55,37.57 35.55,36.82 35.25,36.52 34.5,36.52 | 34.5,36.52 34.41,36.52 | IC14.VCC 34.38,36.52 34.5,36.52
  Top 0.4: IC15.VCC 36.16,40.39 R9.1 | IC14.VCC 33.53,35.65
  Top 0.5: CONN2.2 44.71,34.48 IC1.21 44.71,43.64 v46.26,45.19 | IC1.52 51.11,53.75 52.81,52.04 | v29.5,33 29.7,32.8 32.6,32.8 33.5,33.7 IC14.VCC | IC14.VDD v29.5,33 | v29.5,33
  Top 0.6: 87.45,37.45 C19.2 | 87.45,37.45 R29.2 91.05,37.45 91.75,36.75 91.75,28 v96,23.75 97,22.75 101.9,22.75 | v68.75,60.25 TP4.TP v68.75,51.95 | LED4.A 112,43.77 112,24.54 110.21,22.75 101.9,22.75 | 101.9,22.75 v101.9,21.5 | IC17.VDD v29.81,50.09 v29.8,50.1 | v52.81,51.95 52.81,52.04 | v73.41,33.09 74.71,33.09 R35.1 | v87.25,39.25 87.25,37.65 87.45,37.45 | v73.41,33.09 73.34,33.16 | v73.28,39.06 v73.27,39.06 | 71.69,39.45 72.86,39.45 73.25,39.06 v73.27,39.06 | 71.69,39.45 R46.2 | C43.2 74.21,40 v73.27,39.06 | v73.27,39.06 73.27,33.23 v73.41,33.09 | v68.39,39.55 71.6,39.55 71.69,39.45 | TP3.TP 63.22,71.22 62,70 D7.CAT
  Bottom 0.25: IC19.VCC 36.05,48.5 | IC18.28 v21.25,58.1 | IC18.9 v11.75,58.25 | IC18.6 v10.25,58.25
  Bottom 0.3: 73.06,37.44 73,37.5 | IC4.10_FB 68.75,61.01 68.75,61 IC4.10_FB | IC4.1_VOUT 68.83,64 68.75,64.08 | C34.1 v59.05,36.03 v59.06,36.04
  Bottom 0.4: IC12.VIN2 73.09,38.09 73,38 73,37.5 | IC12.VIN1 73.06,37.44 | IC12.SEL 78.8,36.15 78.8,35.5 IC12.FB
  Bottom 0.5: v29.5,33 29.5,31.76 29.44,31.7 | IC9.5 101.5,20.5 101.9,20.9 v101.9,21.5
  Bottom 0.6: 68.75,61.46 68.75,61.01 v68.75,60.25 58,60.25 56.75,61.5 56.75,62.7 R16.1 | 36.05,48.5 C32.1 34.45,50.1 31.1,50.1 | 43.25,31 43.25,29.25 30.55,16.55 R3.1 30.5,7.8 D1.C | 57,65.2 R20.1 | 80.58,39.85 86.65,39.85 v87.25,39.25 87.19,39.19 IC11.6 | 80.58,39.85 80.73,39.99 80.73,43.77 72.55,51.95 v68.75,51.95 v52.81,51.95 R7.1 46.25,51.95 R41.2 R32.1 R19.2 46.2,45.25 v46.26,45.19 | IC16.!WP! 23.6,45.41 | IC16.!WP! | TP3.TP 67.5,65.63 68.75,64.38 68.75,64.08 68.75,61.46 | R25.1 R20.1 | R20.1 R16.1 | R16.1 56.8,62.54 56.68,62.66 55.18,62.66 | 55.18,62.66 55.21,62.69 | 53.8,62.66 52.32,62.66 52.28,62.7 51.75,62.7 C20.1 | 53.8,62.66 54.69,62.66 | 54.69,62.66 55.18,62.66 | 53.8,62.66 53.75,62.71 IC3.2 53.75,67.5 52.75,68.5 v41.25,68.5 37.5,64.75 37.5,61.55 L1.1 26.12,61.55 | 43.25,31 41.24,31 41.21,30.98 31.75,30.98 31.03,31.7 C4.1 29.44,31.7 | IC16.!WP! 23.6,45.44 | 31.1,50.1 v29.8,50.1 28.1,50.1 C21.1 | IC16.!WP! 23.61,47.52 24.9,48.8 24.9,50.2 | 24.9,50.2 24.9,51.56 IC16.!HOLD! | 26.16,50.15 IC16.VCC 26.16,61.51 26.12,61.55 | 26.12,61.55 25.31,61.55 25.26,61.6 21.3,61.6 | v21.25,58.1 21.3,58.15 21.3,61.6 | v10.25,58.25 10.25,61.6 11.75,61.6 | 11.75,61.6 21.3,61.6 | v11.75,58.25 11.75,61.6 | LED3.A LED4.A | IC8.5 v96,23.75 | C11.2 68.66,61.55 68.75,61.46 | CONN2.2 43.23,31.02 43.25,31 | 80.58,39.85 73.85,39.85 73.27,39.27 v73.27,39.06 73.09,38.88 73.09,38.09 | 78.8,35.5 78.8,35.31 78.9,35.2 78.9,33.63 78.37,33.09 v73.41,33.09 | IC3.4 54.69,62.66 | 26.16,50.15 24.95,50.15 24.9,50.2 | IC13.BAT_IN 78.28,9.42 C29.1 77.75,9.95 D4.C 74.25,11.97 63.97,22.25 v63.97,36.04 67.47,39.55 v68.39,39.55 | C36.1 31,50.2 31.1,50.1
  Bottom 0.6: C21.1 | 26.16,50.15 27.95,50.15 C21.1
VCC_SENSE_PIN  (via drill 0.3)
  Top 0.25: v51,48.5 44.71,54.79 IC1.60
  Bottom 0.25: R8.1 v51,48.5 R7.2
VCOMH
  Bottom 0.25: IC18.27 20.75,55.97 21.55,55.17 C17.2
VGPS  (via drill 0.3)
  Top 0.6: C18.1 83.95,37.5 v82.5,37.5 82.95,37.95 C39.1 TP6.TP 80.02,46.58 C25.+ | v97.25,43.5 97.25,41.44 IC10.VCC
  Bottom 0.25: IC19.VBACK 37.5,55.6 37.7,55.8 39.55,55.8 42.27,53.08 73.52,53.08 C25.+
  Bottom 0.3: 78.7,37.45 78.75,37.5
  Bottom 0.4: IC12.VOUT1 78.65,38.1 78.75,38 78.75,37.7 78.75,37.5 | IC12.VOUT2 78.7,37.45
  Bottom 0.6: IC11.5 86.25,38.6 85.85,39 82.75,39 82.5,38.75 v82.5,37.5 82.3,37.7 78.75,37.7 | C2.1 96.3,38.5 97.25,39.45 v97.25,43.5 94.18,46.57 93.75,46.57 93.25,46.57 80.02,46.57 C25.+
VMID  (via drill 0.3)
  Top 0.25: C40.2 v79.75,43 C39.2
  Bottom 0.25: IC12.VMID 72.88,36.79 72.47,37.2 72.47,39.35 73.59,40.47 77.22,40.47 v79.75,43
VPCC
  Bottom 0.3: R12.2 89.25,63.75 | 89.25,63.75 89.25,62.52 R13.1 | 89.25,63.75 86.53,63.75 86,64.29 IC5.2_VPCC
VUSB  (via drill 0.3)
  Top 0.6: R14.1 R15.1 110.7,62.5 v109,62.5 104,67.5 TP2.TP
  Bottom 0.6: 108,62.5 105.4,62.5 F1.1 | CONN4.VBUS 108,62.5 | 108,62.5 v109,62.5
XTAL1  (via drill 0.3)
  Top 0.25: v47.1,37.25 IC1.24
  Bottom 0.25: C12.2 49,37.55 Q1.Q2 48.7,37.25 v47.1,37.25
XTAL2  (via drill 0.3)
  Top 0.25: IC1.23 46.31,39.79 v46.35,39.75
  Bottom 0.25: C8.2 44.5,39.45 Q1.Q1 44.8,39.75 v46.35,39.75

## Text on the board
tPlace: - | + | GND | JTAG | VUSB | 3V3 | 5V0 | POWER | RX | VLiIon | VCC | TX | TX | RX | GPS PWR / CTRL | VGPS | SWITCH / CRTL | I2C | BT / PROF IND | GPRS | Bluetooth | BT RST | RESET | Miško / rev.3 / ejovrh
bPlace: 3V3 | 5V0 | GND | LiPo